# EasyEDA Pro project BLDC_V1.0.eprj

# Schematic Schematic1
Board Name: NCHANNEL_INVERTER; Create Date: 2025-03-22; Page Name: P1; Project Name: BLDC_V1.0; Schematic Name: Schematic1; Update Date: 2025-03-22; Company: EasyEDA.com; Page Size: A4; Version: V1.0
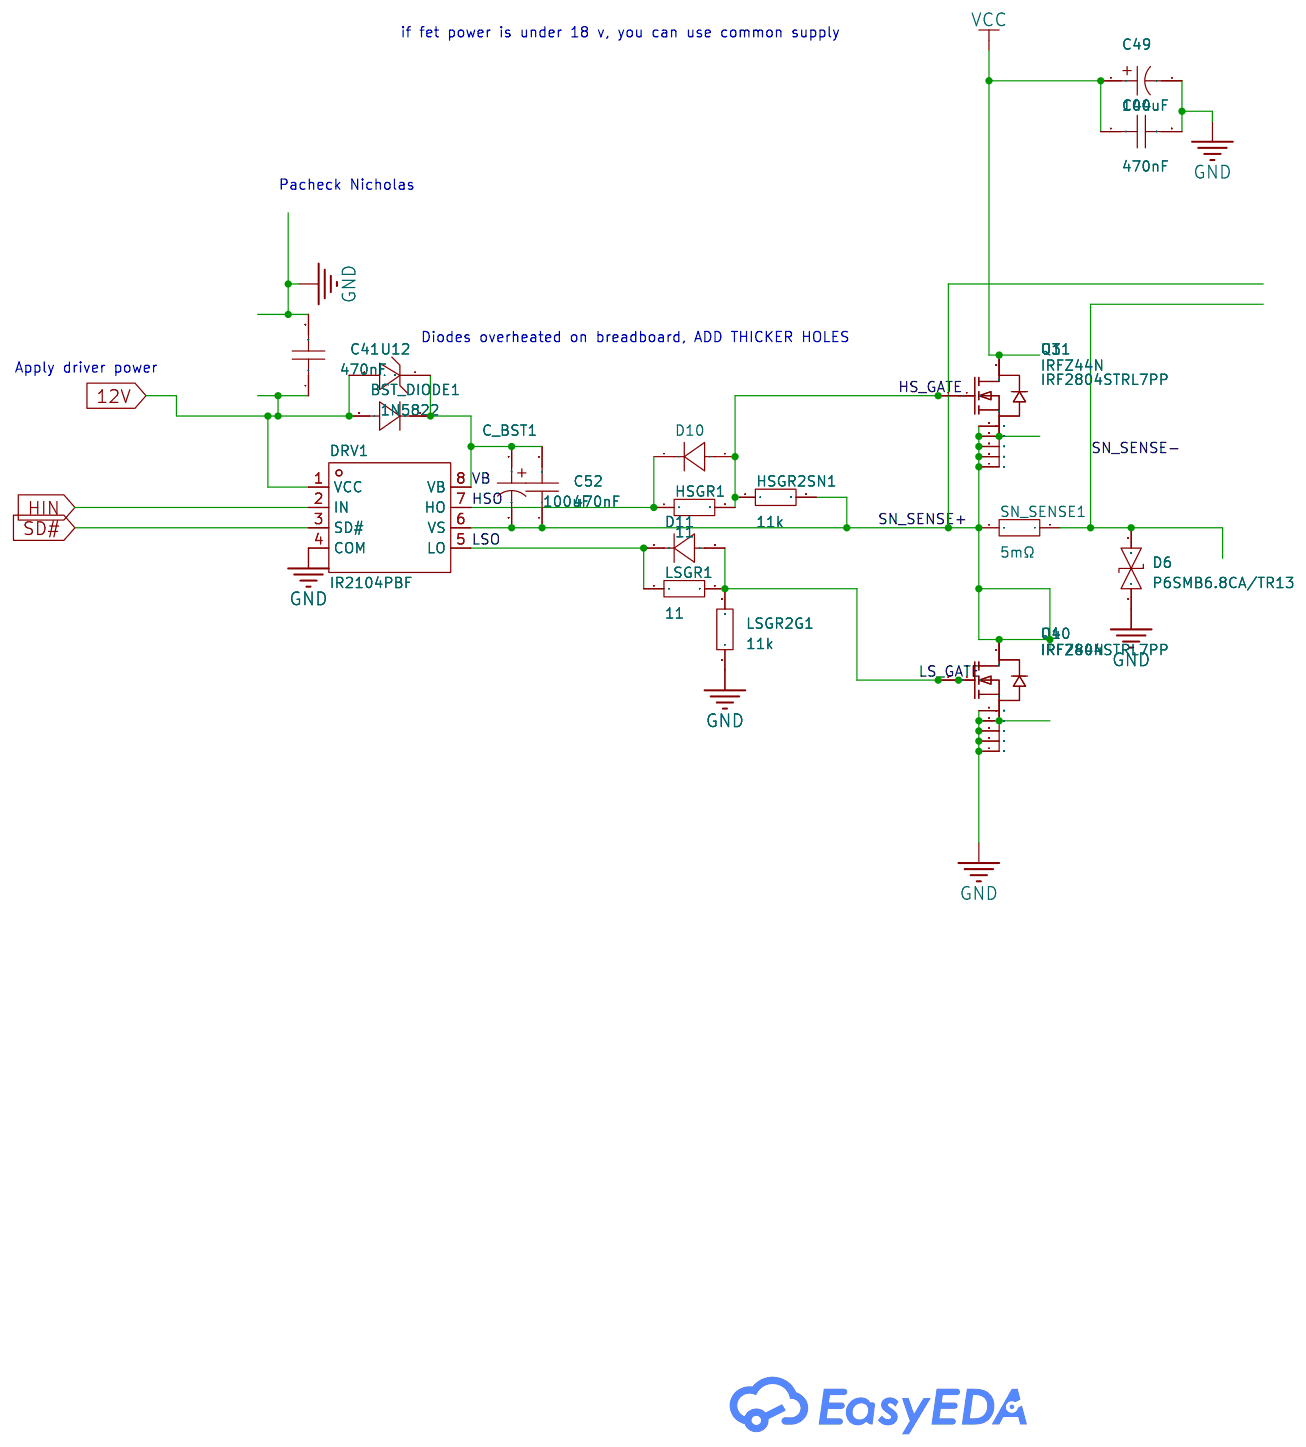
[diagram p0: schematic sheet]

## Parts
BST_DIODE1  -  [DO-41_BD2.4-L4.7-P8.70-D0.9-RD]
C41  470nF  [CAP-TH_L7.2-W2.5-P5.00-D0.5]
C44  470nF  [CAP-TH_L7.2-W2.5-P5.00-D0.5]
C49  100uF  [CAP-TH_BD8.0-P3.50-D0.6-FD]
C52  470nF  [CAP-TH_L7.2-W2.5-P5.00-D0.5]
C_BST1  100uF  [CAP-TH_BD8.0-P3.50-D0.6-FD]
CBB1  -
D6  P6SMB6.8CA/TR13  [SMB_L4.6-W3.6-LS5.3-BI]
D10  -  [DO-41_BD2.4-L4.7-P8.70-D0.9-RD]
D11  -  [DO-41_BD2.4-L4.7-P8.70-D0.9-RD]
DRV1  IR2104PBF  [DIP-8_L9.9-W6.6-P2.54-LS7.62-BL]
HSGR1  11  [RES-TH_BD3.3-L9.0-P13.00-D0.6]
HSGR2SN1  11k  [RES-TH_BD3.3-L9.0-P13.00-D0.6]
LSGR1  11  [RES-TH_BD3.3-L9.0-P13.00-D0.6]
LSGR2G1  11k  [RES-TH_BD3.3-L9.0-P13.00-D0.6]
Q3  IRF2804STRL7PP  [D2PAK-7_L10.6-W9.6-P1.27-LS15.9-BR]
Q4  IRF2804STRL7PP  [D2PAK-7_L10.6-W9.6-P1.27-LS15.9-BR]
SN_SENSE1  5mΩ  [R2512]
U10  IRFZ44N  [TO-220-3_L9.9-W4.5-P2.54-L]
U11  IRFZ44N  [TO-220-3_L9.9-W4.5-P2.54-L]
U12  1N5822  [SMA_L4.3-W2.6-LS5.1-RD]

## Library data of the parts
BST_DIODE1 D10 D11 = 1N4007: Supplier Footprint: DO-41
C41 C44 C52 = C241J474J20C000: Capacitance:470nF Tolerance:±5% Tolerance:±5% Voltage Rated: Dielectric Material:Metallized Polyester Film Capacitor Operating Temperature:-55℃~+125℃ Operating Temperature:-55℃~+125℃; LCSC Part Name: 470nF ±5% 63V; Supplier Part: C5121927; Manufacturer: faratronic(厦门法拉); Supplier Footprint: 插件,P=5mm; JLCPCB Part Class: Extended Part; Datasheet: https://atta.szlcsc.com/upload/public/pdf/source/20220309/53E9D6585E584592026F1B9FCED89B93.pdf; Supplier: LCSC; Tolerance: ±5%; Dielectric Material: Metallized Polyester Film Capacitor; Operating Temperature: -55℃~+125℃
C49 C_BST1 = EGT226M2AF12RR: Capacitance: Tolerance:±20% Tolerance:±20% Rated Voltage: Ripple Current:- Equivalent Series Resistance(ESR):- Lead Spacing: φD:- L:- Lifetime @ Temp:7000hrs@105℃ Operating Temperature:-45℃~+105℃ Operating Temperature:-45℃~+105℃; LCSC Part Name: 22uF ±20% 100V; Supplier Part: C840214; Manufacturer: MAN YUE(万裕科技); Supplier Footprint: 插件; JLCPCB Part Class: Extended Part; Datasheet: https://atta.szlcsc.com/upload/public/pdf/source/20181204/C235371_127DC39C6F805AD99E748A9DC446523D.pdf; Supplier: LCSC; Tolerance: ±20%; Lifetime @ Temp: 7000hrs@105℃; Operating Temperature: -45℃~+105℃
D6 = P6SMB6.8CA/TR13: Reverse Stand-Off Voltage (Vrwm):5.8V Maximum Clamping Voltage:10.5V Peak Pulse Current (Ipp)@10/1000us:58.1A Peak Pulse Power Dissipation (Ppp)@10/1000us:600W Breakdown Voltage:6.45V Type:TVS; Supplier Part: C78395; Manufacturer: Brightking(君耀电子); Supplier Footprint: SMB(DO-214AA); JLCPCB Part Class: Basic Part; Datasheet: https://atta.szlcsc.com/upload/public/pdf/source/20160709/1468031879762.pdf; Supplier: LCSC; Reverse Stand-Off Voltage (Vrwm): 5.8V; Maximum Clamping Voltage: 10.5V; Peak Pulse Current (Ipp)@10/1000us: 58.1A; Peak Pulse Power Dissipation (Ppp)@10/1000us: 600W; Breakdown Voltage: 6.45V; Type: TVS
DRV1 = IR2104PBF: Driven Configuration:Half Bridge Load Type:MOSFET；IGBT Number of Drivers:2 Peak Output Current(sink):360mA Peak Output Current(source):210mA Supply Voltage:10V~20V Supply Voltage:10V~20V Rise Time:100ns Fall Time:50ns Operating Temperature:-40℃~+150℃@(Tj); LCSC Part Name: IR2104PBF 停产; Supplier Part: C2959; Manufacturer: Infineon(英飞凌); Supplier Footprint: PDIP-8; JLCPCB Part Class: Extended Part; Datasheet: https://atta.szlcsc.com/upload/public/pdf/source/20140906/1457707236579.pdf; Supplier: LCSC; Driven Configuration: Half Bridge; Load Type: MOSFET；IGBT; Number of Drivers: 2; Peak Output Current(sink): 360mA; Peak Output Current(source): 210mA; Supply Voltage: 10V~20V; Rise Time: 100ns; Fall Time: 50ns; Operating Temperature: -40℃~+150℃@(Tj)
HSGR1 HSGR2SN1 LSGR1 LSGR2G1 = Res_AXIAL-1/2W: Supplier Footprint: Through
Q3 Q4 = IRF2804STRL7PP: Supplier Part: C459950; Manufacturer: Infineon(英飞凌); Supplier Footprint: TO-252-3; JLCPCB Part Class: Extended Part; Datasheet: https://atta.szlcsc.com/upload/public/pdf/source/20211220/39CD65D483719D465F1A88FFAD2C5DF5.pdf; Supplier: LCSC
SN_SENSE1 = PA2512FKF7W0R005E: Type:Current Sensing Resistors Resistance: Tolerance:±1% Tolerance:±1% Power(Watts): Temperature Coefficient:±100ppm/℃ Temperature Coefficient:±100ppm/℃; LCSC Part Name: 5mΩ ±1% 2W; Supplier Part: C309526; Manufacturer: YAGEO(国巨); Supplier Footprint: 2512; JLCPCB Part Class: Extended Part; Datasheet: https://atta.szlcsc.com/upload/public/pdf/source/20190227/C375693_219964CC8B3EBD36DBDF701587FA5938.pdf; Supplier: LCSC; Type: Current Sensing Resistors; Tolerance: ±1%; Temperature Coefficient: ±100ppm/℃
U10 U11 = IRFZ44N: Type:1个NChannel Drain Source Voltage (Vdss):60V Continuous Drain Current (Id): Power Dissipation (Pd): Drain Source On Resistance (RDS(on)@Vgs,Id):12mΩ@10V,25A Gate Threshold Voltage (Vgs(th)@Id):3V@250uA Total Gate Charge (Qg@Vgs):31nC@10V Input Capacita; LCSC Part Name: 1个N沟道 耐压:60V 电流:60A; Supplier Part: C7429904; Manufacturer: minos(迈诺斯); Supplier Footprint: TO-220; JLCPCB Part Class: Extended Part; Datasheet: https://atta.szlcsc.com/upload/public/pdf/source/20230807/91A846AFF378822B6B73E3D1D52219D8.pdf; Supplier: LCSC; Type: 1个NChannel; Drain Source Voltage (Vdss): 60V; Drain Source On Resistance (RDS(on)@Vgs,Id): 12mΩ@10V,25A; Gate Threshold Voltage (Vgs(th)@Id): 3V@250uA; Total Gate Charge (Qg@Vgs): 31nC@10V; Input Capacitance (Ciss@Vds): 910pF@25V; Reverse Transfer Capacitance (Crss@Vds): 30pF@25V; Operating Temperature: -55℃~+175℃@(Tj)
U12 = 1N5822_C9900009641: Supplier Part: C9900009641; JLCPCB Part Class: Extended Part; Supplier: LCSC

## Nets
12V: BST_DIODE1.2(A) C41.1 DRV1.1(VCC) U12.2(A)
GND: C41.2 C44.2 C49.2 D6.1 DRV1.4(COM) LSGR2G1.1 Q4.2(S) Q4.3(S) Q4.5(S) Q4.6(S) Q4.7(S) U10.3(S)
VCC: C44.1 C49.1 Q3.4(D) U11.2(D)
HIN: DRV1.2(IN)
HS_GATE: D10.2(A) HSGR1.2 HSGR2SN1.1 Q3.1(G) U11.1(G)
HSO: D10.1(K) DRV1.7(HO) HSGR1.1
LS_GATE: D11.2(A) LSGR1.2 LSGR2G1.2 Q4.1(G) U10.1(G)
LSO: D11.1(K) DRV1.5(LO) LSGR1.1
SD#: DRV1.3(SD#)
SN_SENSE+: C52.1 C_BST1.2 CBB1.(CS_AmpOut) D6.2 DRV1.6(VS) HSGR2SN1.2 Q3.2(S) Q3.3(S) Q3.5(S) Q3.6(S) Q3.7(S) Q4.4(D) SN_SENSE1.1 SN_SENSE1.2 U10.2(D) U11.3(S)
VB: BST_DIODE1.1(K) C52.2 C_BST1.1 DRV1.8(VB) U12.1(C)

## Notes on the sheet
- if fet power is under 18 v, you can use common supply
- Pacheck Nicholas
- Diodes overheated on breadboard, ADD THICKER HOLES
- Apply driver power

# Schematic CurrentSenseAmplfier
Board Name: CurrentSenseAmplfier; Create Date: 2025-03-22; Page Name: P1; Project Name: CurrentSenseAmplfier; Schematic Name: CurrentSenseAmplfier; Update Date: 2025-03-22; Company: EasyEDA.com; Page Size: A4; Version: V1.0
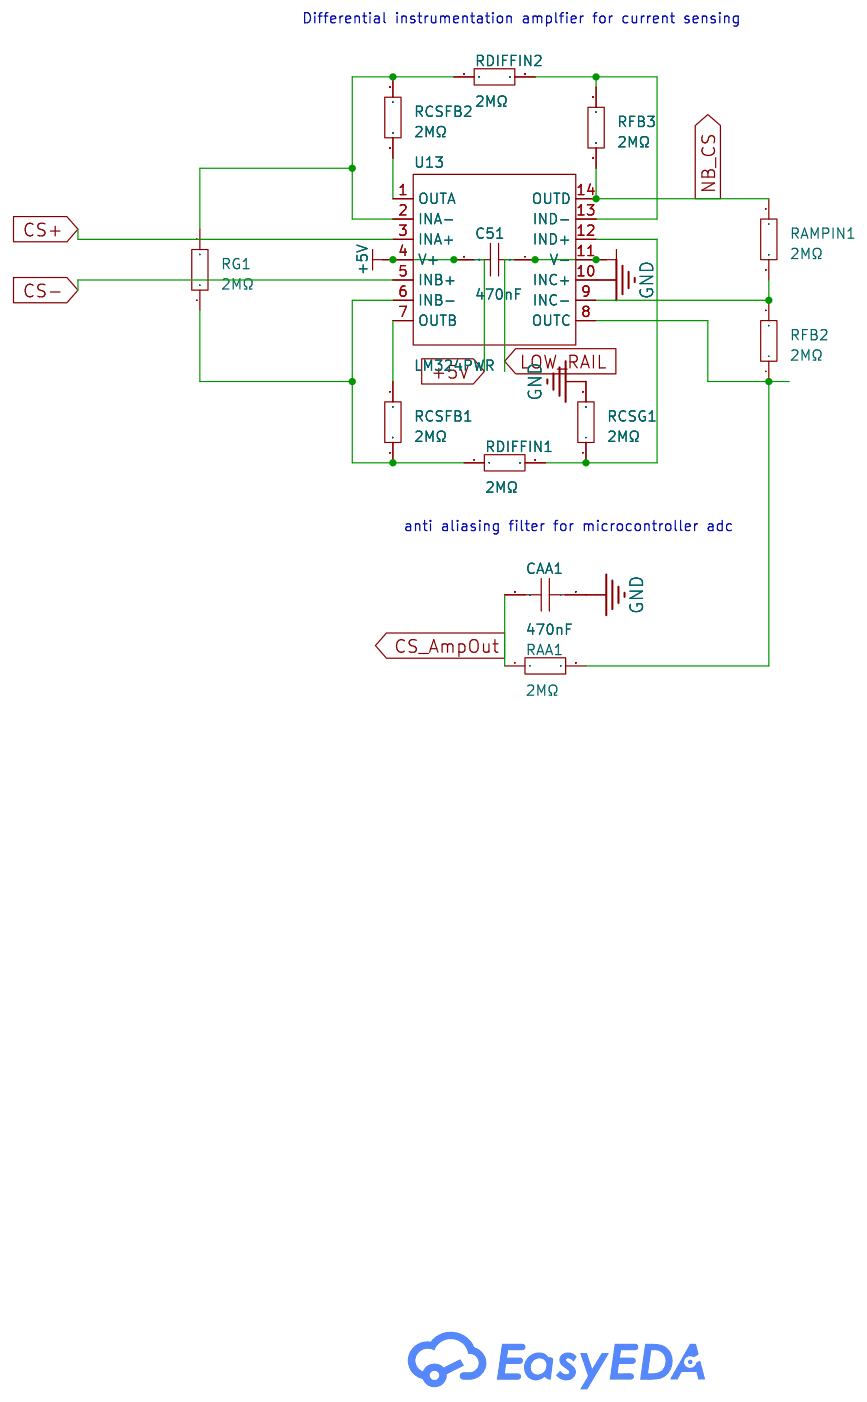
[diagram p1: schematic sheet]

## Parts
C51  470nF  [CAP-TH_L7.2-W2.5-P5.00-D0.5]
CAA1  470nF  [CAP-TH_L7.2-W2.5-P5.00-D0.5]
RAA1  2MΩ  [R0805]
RAMPIN1  2MΩ  [R0805]
RCSFB1  2MΩ  [R0805]
RCSFB2  2MΩ  [R0805]
RCSG1  2MΩ  [R0805]
RDIFFIN1  2MΩ  [R0805]
RDIFFIN2  2MΩ  [R0805]
RFB2  2MΩ  [R0805]
RFB3  2MΩ  [R0805]
RG1  2MΩ  [R0805]
U13  LM324PWR  [TSSOP-14_L5.0-W4.4-P0.65-LS6.4-BL]

## Library data of the parts
C51 CAA1 = C241J474J20C000: Capacitance:470nF Tolerance:±5% Tolerance:±5% Voltage Rated: Dielectric Material:Metallized Polyester Film Capacitor Operating Temperature:-55℃~+125℃ Operating Temperature:-55℃~+125℃; LCSC Part Name: 470nF ±5% 63V; Supplier Part: C5121927; Manufacturer: faratronic(厦门法拉); Supplier Footprint: 插件,P=5mm; JLCPCB Part Class: Extended Part; Datasheet: https://atta.szlcsc.com/upload/public/pdf/source/20220309/53E9D6585E584592026F1B9FCED89B93.pdf; Supplier: LCSC; Tolerance: ±5%; Dielectric Material: Metallized Polyester Film Capacitor; Operating Temperature: -55℃~+125℃
RAA1 RAMPIN1 RCSFB1 RCSFB2 RCSG1 RDIFFIN1 RDIFFIN2 RFB2 RFB3 RG1 = SCR0805J2M: Type:Thick Film Resistors Resistance:2MΩ Tolerance:±5% Tolerance:±5% Power(Watts): Overload Voltage (Max): Operating Temperature Range:-55℃~+155℃ Operating Temperature Range:-55℃~+155℃; LCSC Part Name: 厚膜电阻 2MΩ ±5% 125mW; Supplier Part: C3017921; Manufacturer: VO(翔胜); Supplier Footprint: 0805; JLCPCB Part Class: Extended Part; Datasheet: https://atta.szlcsc.com/upload/public/pdf/source/20220513/247AF9639BA21CF93567DC289CCC6A22.pdf; Supplier: LCSC; Type: Thick Film Resistors; Tolerance: ±5%; Operating Temperature Range: -55℃~+155℃
U13 = LM324PWR: Number of Circuits:Quad Gain Bandwidth Product(GBP):1.2MHz Current - Input Bias(Ib):20nA Slew Rate(SR):0.5V/us Output Current:30mA -3db Bandwidth:- Supply Current:700uA Operating Temperature:0℃~+70℃ Operating Temperature:0℃~+70℃; Supplier Part: C7942; Manufacturer: TI(德州仪器); Supplier Footprint: TSSOP-14; JLCPCB Part Class: Extended Part; Datasheet: http://www.ti.com/cn/lit/gpn/lm324; Supplier: LCSC; Number of Circuits: Quad; Gain Bandwidth Product(GBP): 1.2MHz; Current - Input Bias(Ib): 20nA; Slew Rate(SR): 0.5V/us; Output Current: 30mA; Supply Current: 700uA; Operating Temperature: 0℃~+70℃

## Nets
+5V: C51.2 U13.4(V+)
GND: CAA1.1 RCSG1.2 U13.10(INC+)
CS+: U13.3(INA+)
CS-: U13.5(INB+)
CS_AmpOut: CAA1.2 RAA1.1
LOW_RAIL: C51.1 U13.11(V-)
NB_CS: RAMPIN1.1 RFB3.1 U13.14(OUTD)
$1N640: RAMPIN1.2 RFB2.2 U13.9(INC-)
$1N642: RDIFFIN2.2 RFB3.2 U13.13(IND-)
$1N644: RCSG1.1 RDIFFIN1.2 U13.12(IND+)
$1N647: RCSFB2.1 RDIFFIN2.1 RG1.2 U13.2(INA-)
$1N648: RCSFB1.2 RDIFFIN1.1 RG1.1 U13.6(INB-)
$1N649: RCSFB1.1 U13.7(OUTB)
$1N650: RCSFB2.2 U13.1(OUTA)
$1N669: RAA1.2 RFB2.1 U13.8(OUTC)

## Notes on the sheet
- Differential instrumentation amplfier for current sensing
- anti aliasing filter for microcontroller adc

# Schematic Schematic2_2
Board Name: SPDV4_THT_2; Create Date: 2025-03-22; Page Name: P1; Project Name: BLDCv5; Schematic Name: Schematic2_2; Update Date: 2025-03-22; Company: EasyEDA.com; Drawn: EasyEDA; Page Size: A4; Part Number: JLCPCB-002; Reviewed: EasyEDA; Version: V0.1
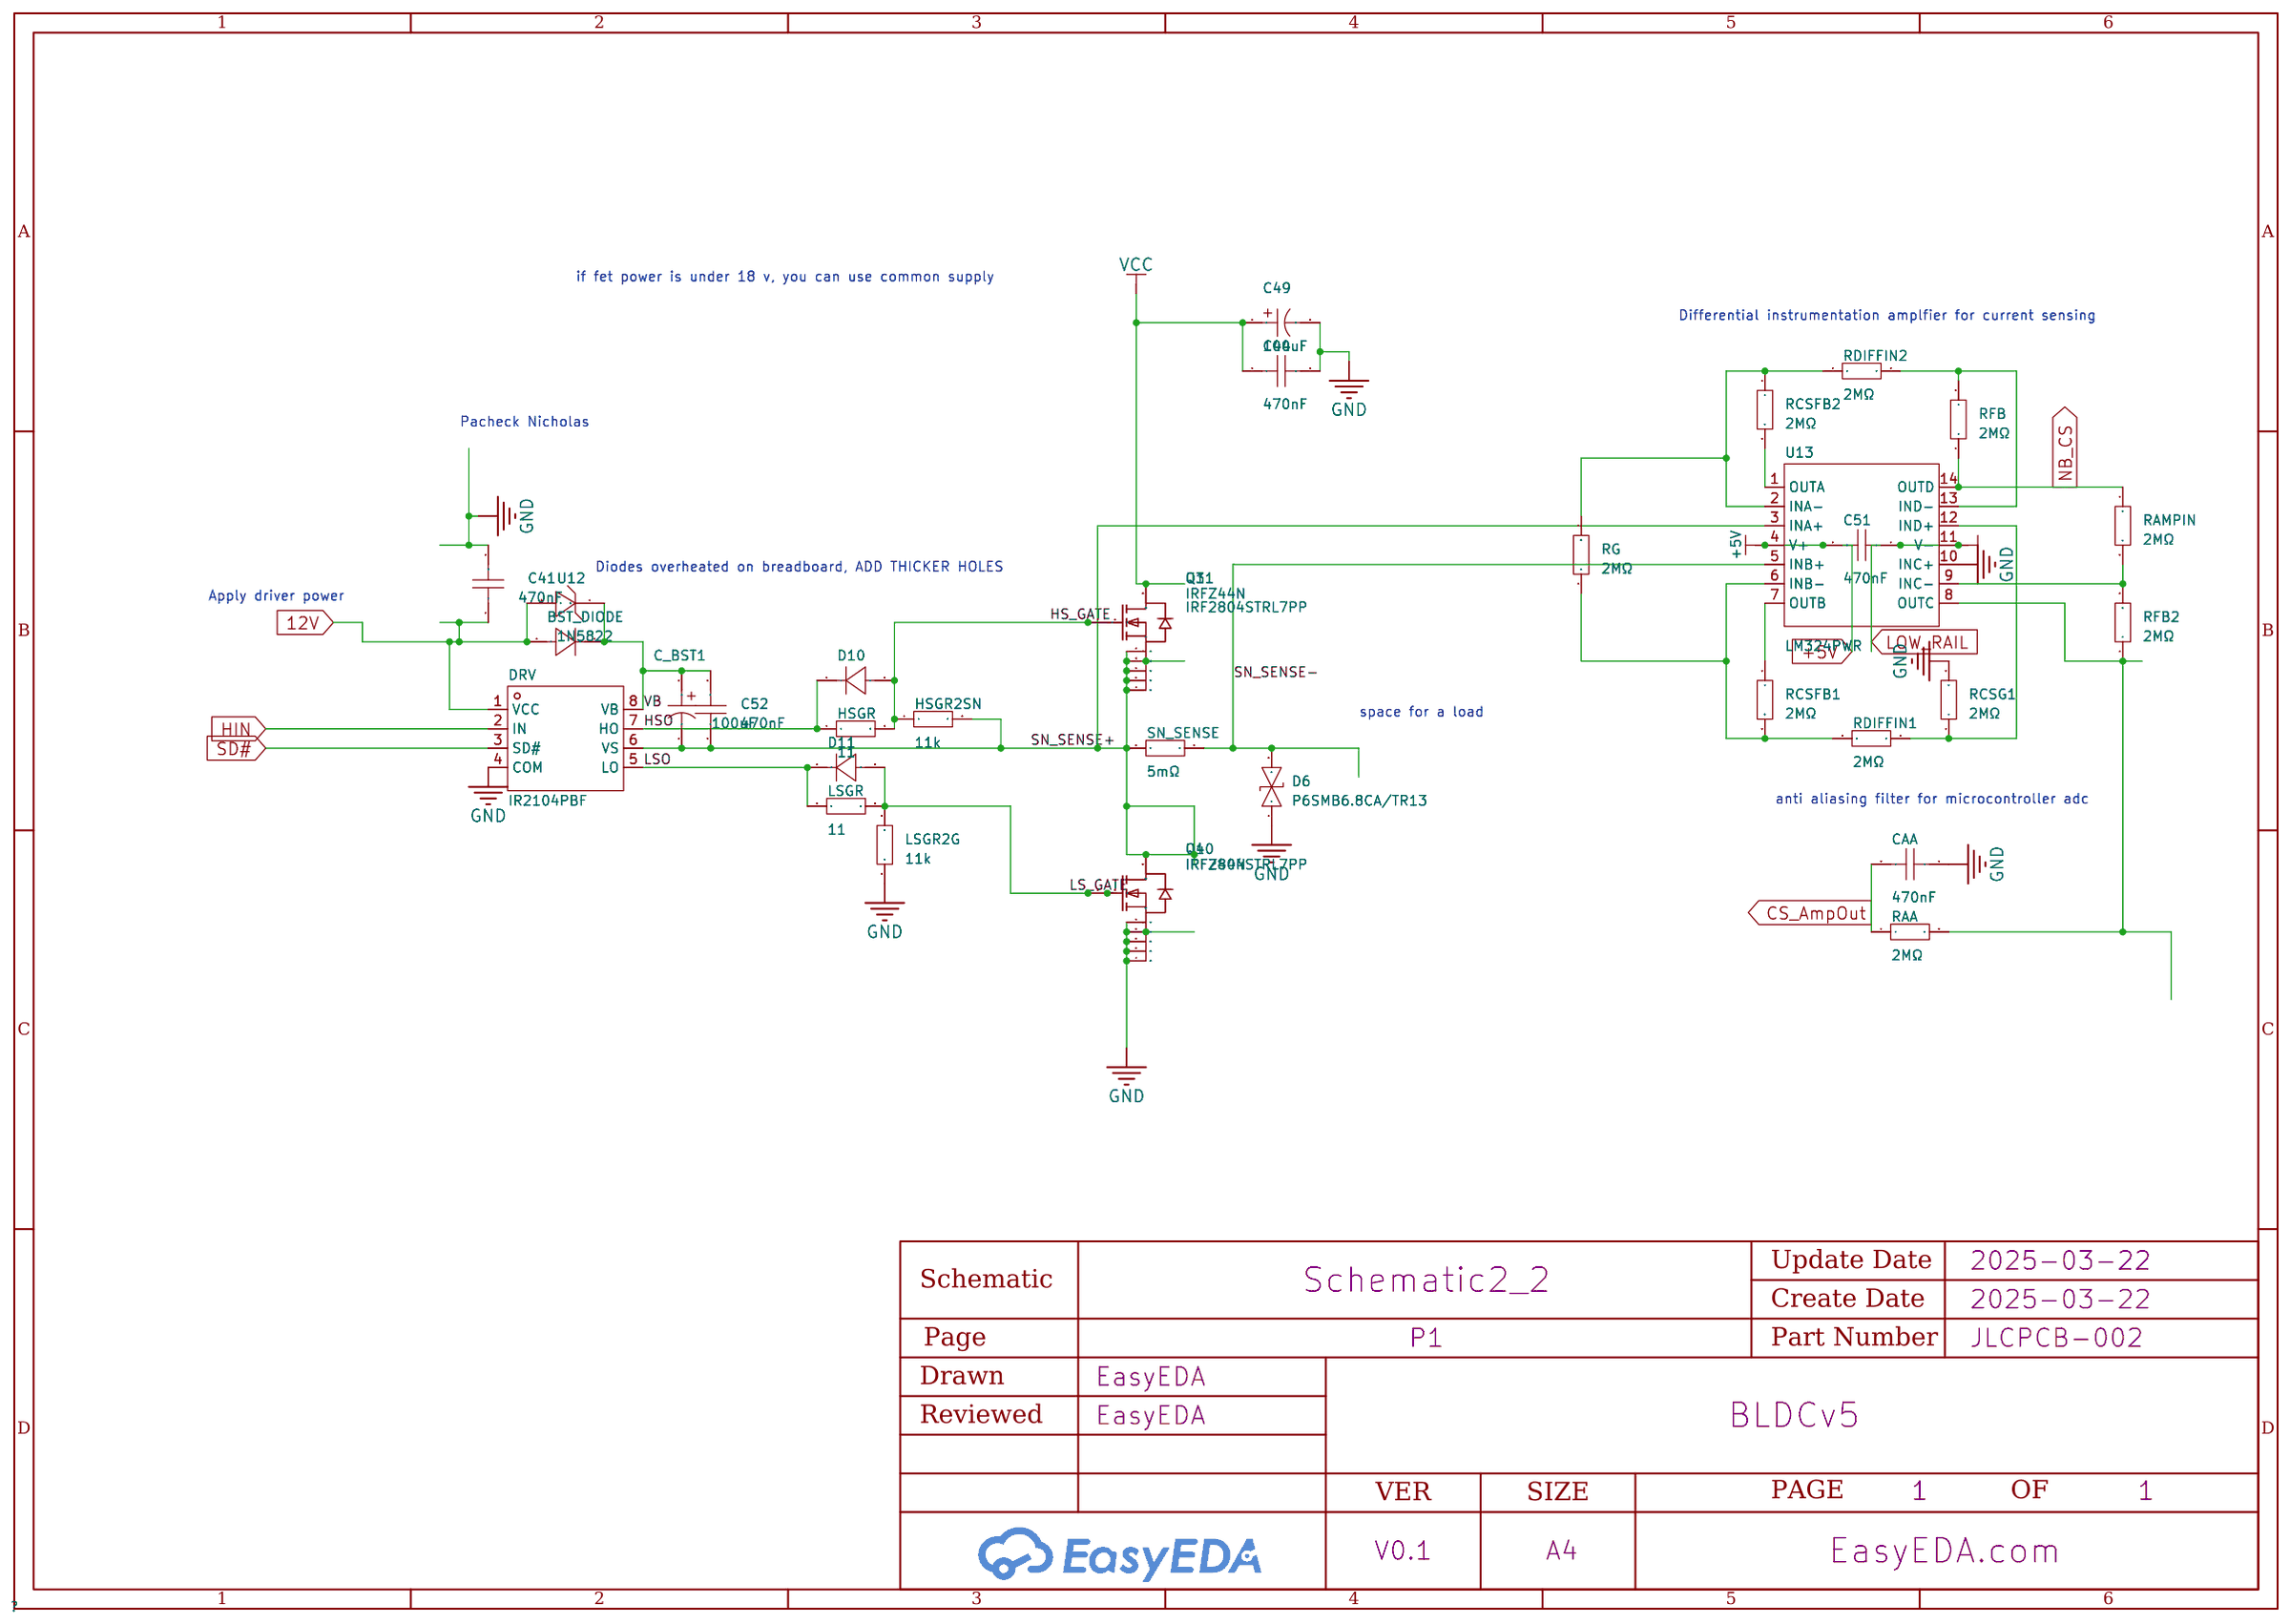
[diagram p2: schematic sheet]

## Parts
BST_DIODE  -  [DO-41_BD2.4-L4.7-P8.70-D0.9-RD]
C41  470nF  [CAP-TH_L7.2-W2.5-P5.00-D0.5]
C44  470nF  [CAP-TH_L7.2-W2.5-P5.00-D0.5]
C49  100uF  [CAP-TH_BD8.0-P3.50-D0.6-FD]
C51  470nF  [CAP-TH_L7.2-W2.5-P5.00-D0.5]
C52  470nF  [CAP-TH_L7.2-W2.5-P5.00-D0.5]
C_BST1  100uF  [CAP-TH_BD8.0-P3.50-D0.6-FD]
CAA  470nF  [CAP-TH_L7.2-W2.5-P5.00-D0.5]
D6  P6SMB6.8CA/TR13  [SMB_L4.6-W3.6-LS5.3-BI]
D10  -  [DO-41_BD2.4-L4.7-P8.70-D0.9-RD]
D11  -  [DO-41_BD2.4-L4.7-P8.70-D0.9-RD]
DRV  IR2104PBF  [DIP-8_L9.9-W6.6-P2.54-LS7.62-BL]
HSGR  11  [RES-TH_BD3.3-L9.0-P13.00-D0.6]
HSGR2SN  11k  [RES-TH_BD3.3-L9.0-P13.00-D0.6]
LSGR  11  [RES-TH_BD3.3-L9.0-P13.00-D0.6]
LSGR2G  11k  [RES-TH_BD3.3-L9.0-P13.00-D0.6]
Q3  IRF2804STRL7PP  [D2PAK-7_L10.6-W9.6-P1.27-LS15.9-BR]
Q4  IRF2804STRL7PP  [D2PAK-7_L10.6-W9.6-P1.27-LS15.9-BR]
RAA  2MΩ  [R0805]
RAMPIN  2MΩ  [R0805]
RCSFB1  2MΩ  [R0805]
RCSFB2  2MΩ  [R0805]
RCSG1  2MΩ  [R0805]
RDIFFIN1  2MΩ  [R0805]
RDIFFIN2  2MΩ  [R0805]
RFB  2MΩ  [R0805]
RFB2  2MΩ  [R0805]
RG  2MΩ  [R0805]
SN_SENSE  5mΩ  [R2512]
U10  IRFZ44N  [TO-220-3_L9.9-W4.5-P2.54-L]
U11  IRFZ44N  [TO-220-3_L9.9-W4.5-P2.54-L]
U12  1N5822  [SMA_L4.3-W2.6-LS5.1-RD]
U13  LM324PWR  [TSSOP-14_L5.0-W4.4-P0.65-LS6.4-BL]

## Library data of the parts
BST_DIODE D10 D11 = 1N4007: Supplier Footprint: DO-41
C41 C44 C51 C52 CAA = C241J474J20C000: Capacitance:470nF Tolerance:±5% Tolerance:±5% Voltage Rated: Dielectric Material:Metallized Polyester Film Capacitor Operating Temperature:-55℃~+125℃ Operating Temperature:-55℃~+125℃; LCSC Part Name: 470nF ±5% 63V; Supplier Part: C5121927; Manufacturer: faratronic(厦门法拉); Supplier Footprint: 插件,P=5mm; JLCPCB Part Class: Extended Part; Datasheet: https://atta.szlcsc.com/upload/public/pdf/source/20220309/53E9D6585E584592026F1B9FCED89B93.pdf; Supplier: LCSC; Tolerance: ±5%; Dielectric Material: Metallized Polyester Film Capacitor; Operating Temperature: -55℃~+125℃
C49 C_BST1 = EGT226M2AF12RR: Capacitance: Tolerance:±20% Tolerance:±20% Rated Voltage: Ripple Current:- Equivalent Series Resistance(ESR):- Lead Spacing: φD:- L:- Lifetime @ Temp:7000hrs@105℃ Operating Temperature:-45℃~+105℃ Operating Temperature:-45℃~+105℃; LCSC Part Name: 22uF ±20% 100V; Supplier Part: C840214; Manufacturer: MAN YUE(万裕科技); Supplier Footprint: 插件; JLCPCB Part Class: Extended Part; Datasheet: https://atta.szlcsc.com/upload/public/pdf/source/20181204/C235371_127DC39C6F805AD99E748A9DC446523D.pdf; Supplier: LCSC; Tolerance: ±20%; Lifetime @ Temp: 7000hrs@105℃; Operating Temperature: -45℃~+105℃
D6 = P6SMB6.8CA/TR13: Reverse Stand-Off Voltage (Vrwm):5.8V Maximum Clamping Voltage:10.5V Peak Pulse Current (Ipp)@10/1000us:58.1A Peak Pulse Power Dissipation (Ppp)@10/1000us:600W Breakdown Voltage:6.45V Type:TVS; Supplier Part: C78395; Manufacturer: Brightking(君耀电子); Supplier Footprint: SMB(DO-214AA); JLCPCB Part Class: Basic Part; Datasheet: https://atta.szlcsc.com/upload/public/pdf/source/20160709/1468031879762.pdf; Supplier: LCSC; Reverse Stand-Off Voltage (Vrwm): 5.8V; Maximum Clamping Voltage: 10.5V; Peak Pulse Current (Ipp)@10/1000us: 58.1A; Peak Pulse Power Dissipation (Ppp)@10/1000us: 600W; Breakdown Voltage: 6.45V; Type: TVS
DRV = IR2104PBF: Driven Configuration:Half Bridge Load Type:MOSFET；IGBT Number of Drivers:2 Peak Output Current(sink):360mA Peak Output Current(source):210mA Supply Voltage:10V~20V Supply Voltage:10V~20V Rise Time:100ns Fall Time:50ns Operating Temperature:-40℃~+150℃@(Tj); LCSC Part Name: IR2104PBF 停产; Supplier Part: C2959; Manufacturer: Infineon(英飞凌); Supplier Footprint: PDIP-8; JLCPCB Part Class: Extended Part; Datasheet: https://atta.szlcsc.com/upload/public/pdf/source/20140906/1457707236579.pdf; Supplier: LCSC; Driven Configuration: Half Bridge; Load Type: MOSFET；IGBT; Number of Drivers: 2; Peak Output Current(sink): 360mA; Peak Output Current(source): 210mA; Supply Voltage: 10V~20V; Rise Time: 100ns; Fall Time: 50ns; Operating Temperature: -40℃~+150℃@(Tj)
HSGR HSGR2SN LSGR LSGR2G = Res_AXIAL-1/2W: Supplier Footprint: Through
Q3 Q4 = IRF2804STRL7PP: Supplier Part: C459950; Manufacturer: Infineon(英飞凌); Supplier Footprint: TO-252-3; JLCPCB Part Class: Extended Part; Datasheet: https://atta.szlcsc.com/upload/public/pdf/source/20211220/39CD65D483719D465F1A88FFAD2C5DF5.pdf; Supplier: LCSC
RAA RAMPIN RCSFB1 RCSFB2 RCSG1 RDIFFIN1 RDIFFIN2 RFB RFB2 RG = SCR0805J2M: Type:Thick Film Resistors Resistance:2MΩ Tolerance:±5% Tolerance:±5% Power(Watts): Overload Voltage (Max): Operating Temperature Range:-55℃~+155℃ Operating Temperature Range:-55℃~+155℃; LCSC Part Name: 厚膜电阻 2MΩ ±5% 125mW; Supplier Part: C3017921; Manufacturer: VO(翔胜); Supplier Footprint: 0805; JLCPCB Part Class: Extended Part; Datasheet: https://atta.szlcsc.com/upload/public/pdf/source/20220513/247AF9639BA21CF93567DC289CCC6A22.pdf; Supplier: LCSC; Type: Thick Film Resistors; Tolerance: ±5%; Operating Temperature Range: -55℃~+155℃
SN_SENSE = PA2512FKF7W0R005E: Type:Current Sensing Resistors Resistance: Tolerance:±1% Tolerance:±1% Power(Watts): Temperature Coefficient:±100ppm/℃ Temperature Coefficient:±100ppm/℃; LCSC Part Name: 5mΩ ±1% 2W; Supplier Part: C309526; Manufacturer: YAGEO(国巨); Supplier Footprint: 2512; JLCPCB Part Class: Extended Part; Datasheet: https://atta.szlcsc.com/upload/public/pdf/source/20190227/C375693_219964CC8B3EBD36DBDF701587FA5938.pdf; Supplier: LCSC; Type: Current Sensing Resistors; Tolerance: ±1%; Temperature Coefficient: ±100ppm/℃
U10 U11 = IRFZ44N: Type:1个NChannel Drain Source Voltage (Vdss):60V Continuous Drain Current (Id): Power Dissipation (Pd): Drain Source On Resistance (RDS(on)@Vgs,Id):12mΩ@10V,25A Gate Threshold Voltage (Vgs(th)@Id):3V@250uA Total Gate Charge (Qg@Vgs):31nC@10V Input Capacita; LCSC Part Name: 1个N沟道 耐压:60V 电流:60A; Supplier Part: C7429904; Manufacturer: minos(迈诺斯); Supplier Footprint: TO-220; JLCPCB Part Class: Extended Part; Datasheet: https://atta.szlcsc.com/upload/public/pdf/source/20230807/91A846AFF378822B6B73E3D1D52219D8.pdf; Supplier: LCSC; Type: 1个NChannel; Drain Source Voltage (Vdss): 60V; Drain Source On Resistance (RDS(on)@Vgs,Id): 12mΩ@10V,25A; Gate Threshold Voltage (Vgs(th)@Id): 3V@250uA; Total Gate Charge (Qg@Vgs): 31nC@10V; Input Capacitance (Ciss@Vds): 910pF@25V; Reverse Transfer Capacitance (Crss@Vds): 30pF@25V; Operating Temperature: -55℃~+175℃@(Tj)
U12 = 1N5822_C9900009641: Supplier Part: C9900009641; JLCPCB Part Class: Extended Part; Supplier: LCSC
U13 = LM324PWR: Number of Circuits:Quad Gain Bandwidth Product(GBP):1.2MHz Current - Input Bias(Ib):20nA Slew Rate(SR):0.5V/us Output Current:30mA -3db Bandwidth:- Supply Current:700uA Operating Temperature:0℃~+70℃ Operating Temperature:0℃~+70℃; Supplier Part: C7942; Manufacturer: TI(德州仪器); Supplier Footprint: TSSOP-14; JLCPCB Part Class: Extended Part; Datasheet: http://www.ti.com/cn/lit/gpn/lm324; Supplier: LCSC; Number of Circuits: Quad; Gain Bandwidth Product(GBP): 1.2MHz; Current - Input Bias(Ib): 20nA; Slew Rate(SR): 0.5V/us; Output Current: 30mA; Supply Current: 700uA; Operating Temperature: 0℃~+70℃

## Nets
12V: BST_DIODE.2(A) C41.1 DRV.1(VCC) U12.2(A)
+5V: C51.2 U13.4(V+)
GND: C41.2 C44.2 C49.2 CAA.1 D6.1 DRV.4(COM) LSGR2G.1 Q4.2(S) Q4.3(S) Q4.5(S) Q4.6(S) Q4.7(S) RCSG1.2 U10.3(S) U13.10(INC+)
VCC: C44.1 C49.1 Q3.4(D) U11.2(D)
CS_AmpOut: CAA.2 RAA.1
HIN: DRV.2(IN)
HS_GATE: D10.2(A) HSGR.2 HSGR2SN.1 Q3.1(G) U11.1(G)
HSO: D10.1(K) DRV.7(HO) HSGR.1
LOW_RAIL: C51.1 U13.11(V-)
LS_GATE: D11.2(A) LSGR.2 LSGR2G.2 Q4.1(G) U10.1(G)
LSO: D11.1(K) DRV.5(LO) LSGR.1
NB_CS: RAMPIN.1 RFB.1 U13.14(OUTD)
SD#: DRV.3(SD#)
SN_SENSE+: C52.1 C_BST1.2 DRV.6(VS) HSGR2SN.2 Q3.2(S) Q3.3(S) Q3.5(S) Q3.6(S) Q3.7(S) Q4.4(D) SN_SENSE.2 U10.2(D) U11.3(S) U13.3(INA+)
SN_SENSE-: D6.2 SN_SENSE.1 U13.5(INB+)
VB: BST_DIODE.1(K) C52.2 C_BST1.1 DRV.8(VB) U12.1(C)
$1N9618: RCSFB2.2 U13.1(OUTA)
$1N9619: RCSFB1.1 U13.7(OUTB)
$1N9620: RCSFB1.2 RDIFFIN1.1 RG.1 U13.6(INB-)
$1N9621: RCSFB2.1 RDIFFIN2.1 RG.2 U13.2(INA-)
$1N9624: RCSG1.1 RDIFFIN1.2 U13.12(IND+)
$1N9626: RDIFFIN2.2 RFB.2 U13.13(IND-)
$1N9695: RAMPIN.2 RFB2.2 U13.9(INC-)
$1N10041: RAA.2 RFB2.1 U13.8(OUTC)

## Notes on the sheet
- if fet power is under 18 v, you can use common supply
- Differential instrumentation amplfier for current sensing
- Pacheck Nicholas
- Diodes overheated on breadboard, ADD THICKER HOLES
- Apply driver power
- space for a load
- anti aliasing filter for microcontroller adc

# Board CurrentSenseAmplfier
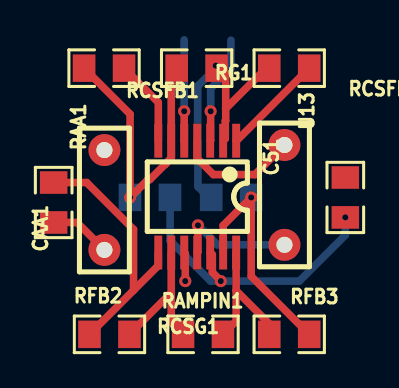
[diagram p3: board, top side]
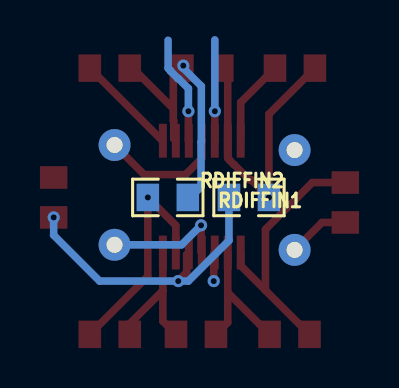
[diagram p4: board, bottom side, seen from below]

No outline. copper layers: Top Layer, Bottom Layer. Coordinates in mm from the lowest, leftmost part position.
Stack: Top Layer 0.035mm / Dielectric1 1.51mm FR4 er 4.5 / Bottom Layer 0.035mm

## Design rules (mm)
template: JLCPCB Capability(Two Layers Board)
spacing copperThickness1oz (default): track to track 0.102, other pairs 0.152 to 0.3
spacing copperThickness2oz: track to track 0.203, other pairs 0.152 to 0.3
track width copperThickness1oz (default): min 0.127, default 0.254, max 2.54
track width copperThickness2oz: min 0.203, default 0.254, max 2.54
differential pair differentialPair (default): width min 0.127, default 0.254, max 2.54; gap min 0.152, default 0.152
via viaSize (default): diameter min 0.5, default 0.61, max 10; hole min 0.3, default 0.305, max 6.3

## Placement (name value [footprint] x y rotation side)
C51  470nF  [CAP-TH_L7.2-W2.5-P5.00-D0.5]  11.56 6.98 90 top
CAA1  470nF  [CAP-TH_L7.2-W2.5-P5.00-D0.5]  2.54 6.73 270 top
RAA1  2MΩ  [R0805]  0 6.6 90 top
RAMPIN1  2MΩ  [R0805]  7.48 0 180 top
RCSFB1  2MΩ  [R0805]  2.52 13.33 180 top
RCSFB2  2MΩ  [R0805]  11.8 13.33 0 top
RCSG1  2MΩ  [R0805]  14.6 6.86 90 top
RDIFFIN1  2MΩ  [R0805]  4.83 6.86 0 bottom
RDIFFIN2  2MΩ  [R0805]  8.89 6.86 0 bottom
RFB2  2MΩ  [R0805]  2.79 0 0 top
RFB3  2MΩ  [R0805]  11.8 0 0 top
RG1  2MΩ  [R0805]  7.16 13.33 0 top
U13  LM324PWR  [TSSOP-14_L5.0-W4.4-P0.65-LS6.4-BL]  7.19 6.9 180 top

## Footprints (pads in the part's own frame, mm; a bottom-side part is the same pattern mirrored in y, then rotated)
CAP-TH_L7.2-W2.5-P5.00-D0.5
  round 1.6 hole 0.8: 1(-2.5,0) 2(2.5,0)
R0805
  rect 1.133x1.377 smd: 1(-1,0) 2(1,0)
TSSOP-14_L5.0-W4.4-P0.65-LS6.4-BL
  rect 0.4x1.7 smd: 1(-1.95,-2.8) 2(-1.3,-2.8) 3(-0.65,-2.8) 4(0,-2.8) 5(0.65,-2.8) 6(1.3,-2.8) 7(1.95,-2.8) 8(1.95,2.8) 9(1.3,2.8) 10(0.65,2.8) 11(0,2.8) 12(-0.65,2.8) 13(-1.3,2.8) 14(-1.95,2.8)

## Nets
As in the schematic, except:
CS_AMPOUT: CAA1.2 RAA1.1

## Via types
v1: diameter 0.61, hole 0.305, Top Layer to Bottom Layer, 9 vias

## Routing (per net, layer and track width the routed paths; a pad name or vN(x,y) marks a point on that pad's centre or on a via; arc(x,y) is an arc through that point)
+5V: length 6.2
  Top Layer w0.381: C51.2 10.07,8 8,8 7.19,8.81 U13.4
GND: length 1.5
  Top Layer w0.381: v1(6.59,2.67) 6.59,4.05 U13.10
CS+: length 5.5
  Top Layer w0.381: U13.3 7.86,9.72 v1(7.86,11.18)
  Bottom Layer w0.381: 8.88,14.73 8.88,13.33 8.76,13.22 8.76,13.19 8.38,12.81 8.35,12.81 7.86,12.32 v1(7.86,11.18)
CS-: length 5.1
  Top Layer w0.381: v1(6.53,11.18) 6.53,9.7 U13.5
  Bottom Layer w0.381: v1(6.53,11.18) 6.53,14.75
CS_AMPOUT: length 3.1
  Top Layer w0.381: CAA1.2 1.17,5.6 RAA1.1
LOW_RAIL: length 6.1
  Top Layer w0.381: v1(7.22,5.46) 7.22,4.14 U13.11
  Bottom Layer w0.381: v1(7.22,5.46) 8.2,4.48 C51.1
NB_CS: length 7.3
  Top Layer w0.381: RFB3.1 10.8,0.53 9.14,2.19 ; 9.14,2.19 9.14,0.66 RAMPIN1.1 ; 9.14,2.19 U13.14
$1N640: length 7.3
  Top Layer w0.381: 5.89,2.09 U13.9 ; 5.89,2.09 RFB2.2 ; 5.89,2.09 5.89,0.59 RAMPIN1.2
$1N642: length 11.4
  Top Layer w0.381: RFB3.2 9.89,2.91 v1(9.89,6.86) 8.49,5.46 U13.13
$1N644: length 15.3
  Top Layer w0.381: v1(8.37,2.67) 8.37,2.68 7.94,3.11 7.94,3.99 U13.12
  Bottom Layer w0.381: RDIFFIN1.2 5.83,4.7 7.86,2.67 v1(8.37,2.67) 12.3,2.67 14.6,4.97 v1(14.6,5.86)
$1N647: length 14.3
  Top Layer w0.381: RCSFB2.1 10.64,13.33 8.61,11.31 ; 8.61,11.31 8.61,10.71 8.59,10.69 8.59,9.81 U13.2 ; 8.61,11.31 8.61,13.01 8.29,13.33 RG1.2
  Bottom Layer w0.381: v1(8.11,13.46) 8.11,13.33 7.21,12.43 7.21,9.64 7.22,9.63 7.22,7.4 7.76,6.86 RDIFFIN2.1
$1N648: length 14.9
  Top Layer w0.381: RCSFB1.2 3.83,11.03 v1(3.83,6.86) 4.72,7.75 4.81,7.75 5.57,8.51 5.58,8.51 5.78,8.71 5.78,8.72 5.89,8.82 U13.6 5.89,13.06 RG1.1
$1N649: length 4.3
  Top Layer w0.381: U13.7 5.24,11.62 RCSFB1.1
$1N650: length 5.2
  Top Layer w0.381: RCSFB2.2 9.16,9.7 U13.1
$1N669: length 13.5
  Top Layer w0.381: 4,2.21 5.24,3.44 U13.8 ; 4,2.21 4,5.26 1.65,7.6 RAA1.2 ; 4,2.21 RFB2.1

# Board PCB5
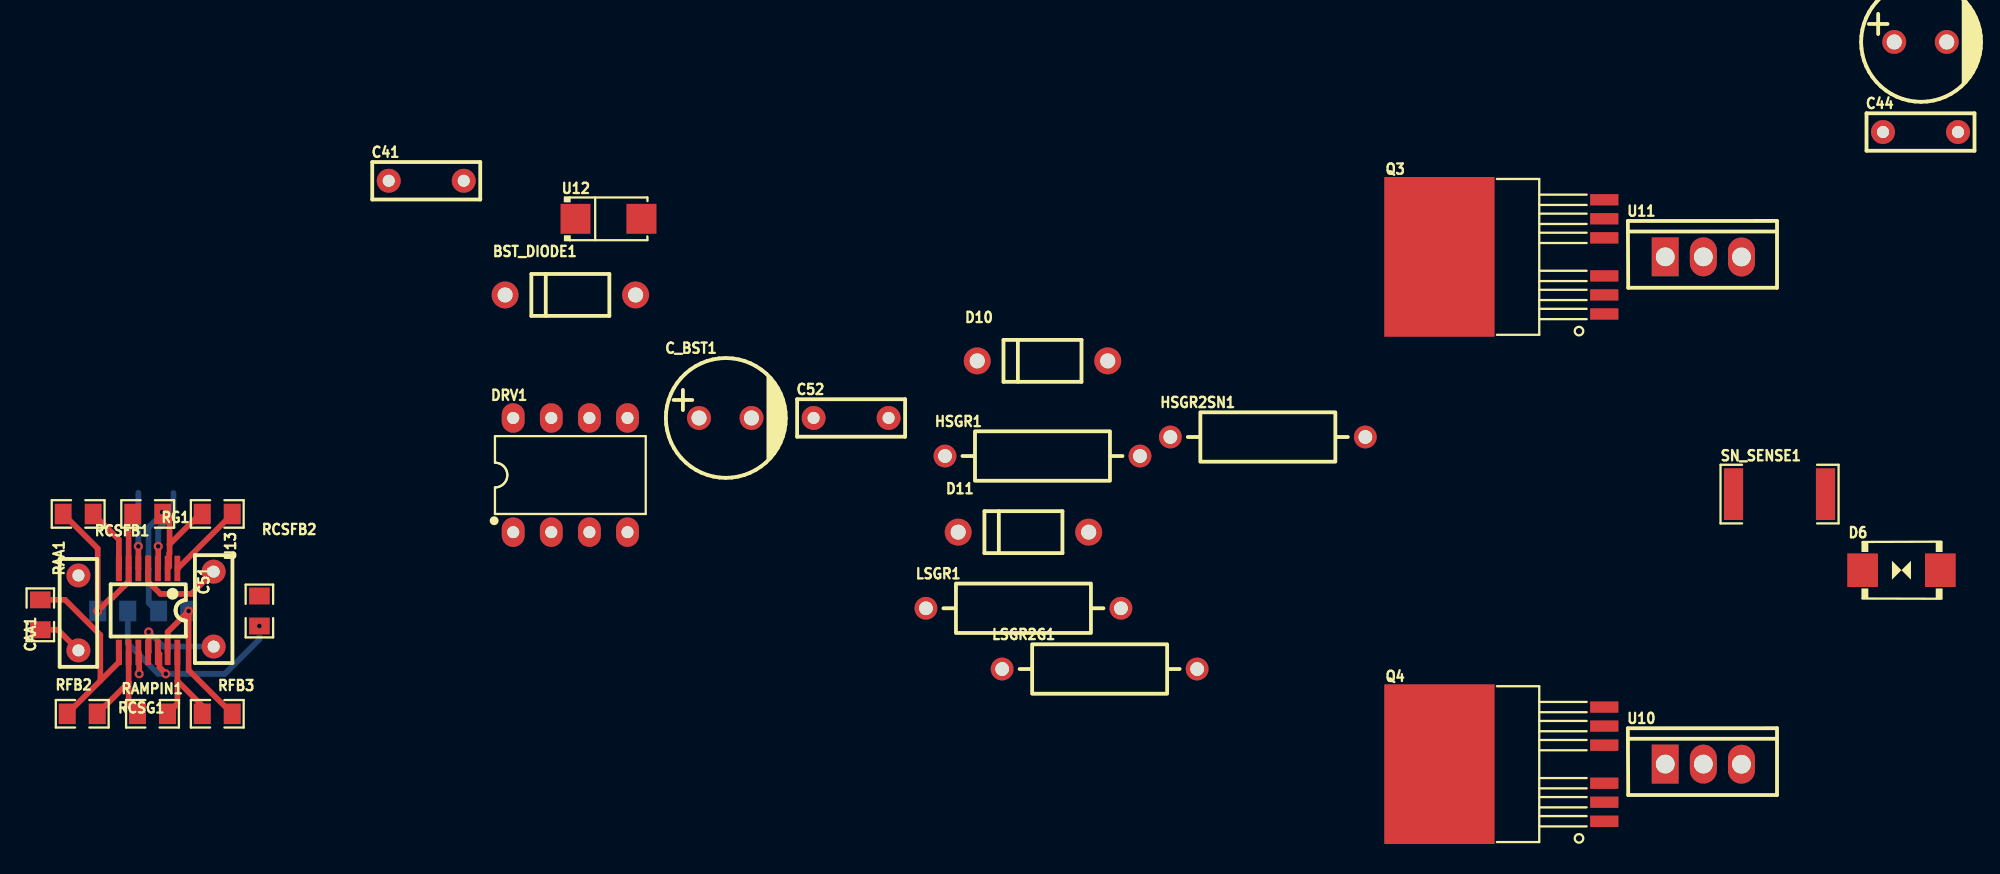
[diagram p5: board, top side]
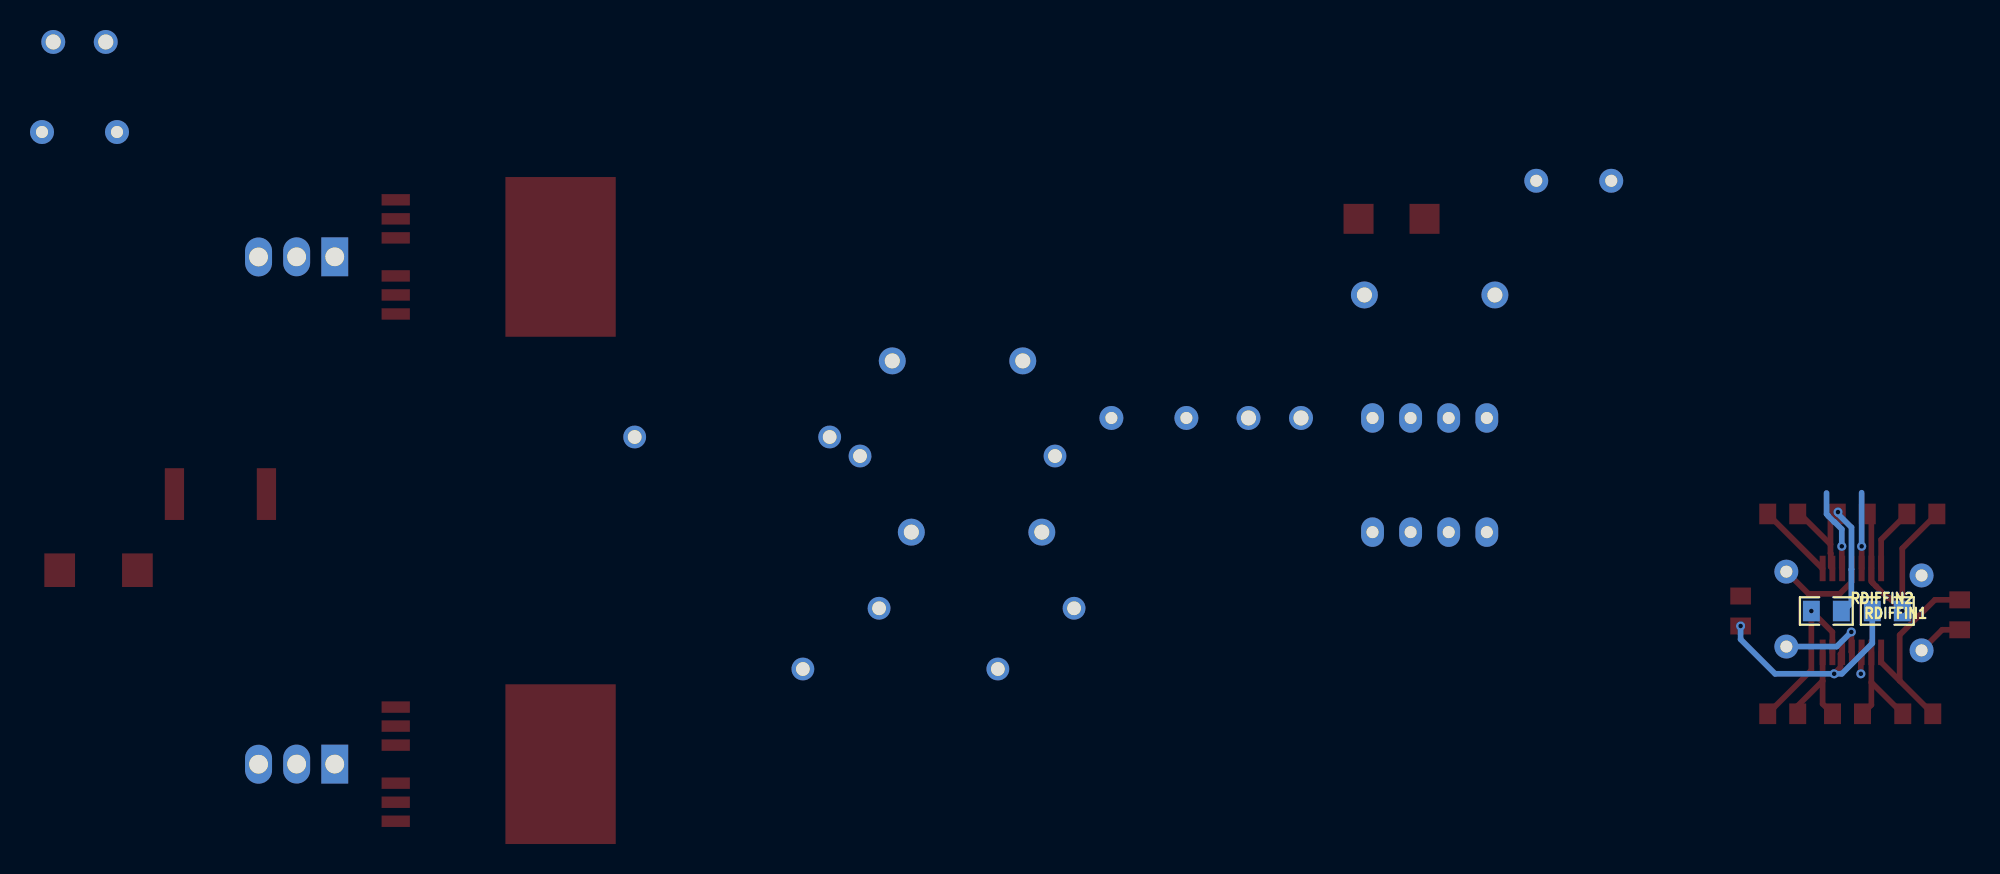
[diagram p6: board, bottom side, seen from below]

No outline. copper layers: Top Layer, Bottom Layer. Coordinates in mm from the lowest, leftmost part position.
Stack: Top Layer 0.035mm / Dielectric1 1.51mm FR4 er 4.5 / Bottom Layer 0.035mm

## Design rules (mm)
template: JLCPCB Capability(Two Layers Board)
spacing copperThickness1oz (default): track to track 0.102, other pairs 0.152 to 0.3
spacing copperThickness2oz: track to track 0.203, other pairs 0.152 to 0.3
track width copperThickness1oz (default): min 0.127, default 0.254, max 2.54
track width copperThickness2oz: min 0.203, default 0.254, max 2.54
differential pair differentialPair (default): width min 0.127, default 0.254, max 2.54; gap min 0.152, default 0.152
via viaSize (default): diameter min 0.5, default 0.61, max 10; hole min 0.3, default 0.305, max 6.3

## Placement (name value [footprint] x y rotation side)
BST_DIODE1  -  [DO-41_BD2.4-L4.7-P8.70-D0.9-RD]  35.34 31.31 0 top
C41  470nF  [CAP-TH_L7.2-W2.5-P5.00-D0.5]  25.73 38.93 0 top
C44  470nF  [CAP-TH_L7.2-W2.5-P5.00-D0.5]  125.35 42.19 0 top
C49  100uF  [CAP-TH_BD8.0-P3.50-D0.6-FD]  125.35 48.2 0 top
C51  470nF  [CAP-TH_L7.2-W2.5-P5.00-D0.5]  11.56 10.35 90 top
C52  470nF  [CAP-TH_L7.2-W2.5-P5.00-D0.5]  54.06 23.1 0 top
C_BST1  100uF  [CAP-TH_BD8.0-P3.50-D0.6-FD]  45.66 23.1 0 top
CAA1  470nF  [CAP-TH_L7.2-W2.5-P5.00-D0.5]  2.54 10.09 270 top
D6  P6SMB6.8CA/TR13  [SMB_L4.6-W3.6-LS5.3-BI]  124.08 12.94 0 top
D10  -  [DO-41_BD2.4-L4.7-P8.70-D0.9-RD]  66.81 26.91 0 top
D11  -  [DO-41_BD2.4-L4.7-P8.70-D0.9-RD]  65.54 15.48 0 top
DRV1  IR2104PBF  [DIP-8_L9.9-W6.6-P2.54-LS7.62-BL]  35.34 19.29 0 top
HSGR1  11  [RES-TH_BD3.3-L9.0-P13.00-D0.6]  66.81 20.56 0 top
HSGR2SN1  11k  [RES-TH_BD3.3-L9.0-P13.00-D0.6]  81.84 21.83 0 top
LSGR1  11  [RES-TH_BD3.3-L9.0-P13.00-D0.6]  65.54 10.4 0 top
LSGR2G1  11k  [RES-TH_BD3.3-L9.0-P13.00-D0.6]  70.62 6.35 0 top
Q3  IRF2804STRL7PP  [D2PAK-7_L10.6-W9.6-P1.27-LS15.9-BR]  98.77 33.85 0 top
Q4  IRF2804STRL7PP  [D2PAK-7_L10.6-W9.6-P1.27-LS15.9-BR]  98.77 0 0 top
RAA1  2MΩ  [R0805]  0 9.97 90 top
RAMPIN1  2MΩ  [R0805]  7.48 3.36 180 top
RCSFB1  2MΩ  [R0805]  2.52 16.7 180 top
RCSFB2  2MΩ  [R0805]  11.8 16.7 0 top
RCSG1  2MΩ  [R0805]  14.6 10.22 90 top
RDIFFIN1  2MΩ  [R0805]  4.83 10.22 0 bottom
RDIFFIN2  2MΩ  [R0805]  8.89 10.22 0 bottom
RFB2  2MΩ  [R0805]  2.79 3.36 0 top
RFB3  2MΩ  [R0805]  11.8 3.36 0 top
RG1  2MΩ  [R0805]  7.16 16.7 0 top
SN_SENSE1  5mΩ  [R2512]  115.96 18.02 0 top
U10  IRFZ44N  [TO-220-3_L9.9-W4.5-P2.54-L]  110.88 0 0 top
U11  IRFZ44N  [TO-220-3_L9.9-W4.5-P2.54-L]  110.88 33.85 0 top
U12  1N5822  [SMA_L4.3-W2.6-LS5.1-RD]  37.88 36.39 0 top
U13  LM324PWR  [TSSOP-14_L5.0-W4.4-P0.65-LS6.4-BL]  7.19 10.26 180 top

## Footprints (pads in the part's own frame, mm; a bottom-side part is the same pattern mirrored in y, then rotated)
CAP-TH_BD8.0-P3.50-D0.6-FD
  round 1.6 hole 1: 1(-1.75,0) 2(1.75,0)
CAP-TH_L7.2-W2.5-P5.00-D0.5
  round 1.6 hole 0.8: 1(-2.5,0) 2(2.5,0)
D2PAK-7_L10.6-W9.6-P1.27-LS15.9-BR
  rect 1.887x0.762 smd: 1(5.495,-3.81) 2(5.495,-2.54) 3(5.495,-1.27) 5(5.495,1.27) 6(5.495,2.54) 7(5.495,3.81)
  rect 7.356x10.66 smd: 4(-5.495,0)
DIP-8_L9.9-W6.6-P2.54-LS7.62-BL
  oval 1.524x1.97 hole 0.8: 1(-3.81,-3.81) 2(-1.27,-3.81) 3(1.27,-3.81) 4(3.81,-3.81) 5(3.81,3.81) 6(1.27,3.81) 7(-1.27,3.81) 8(-3.81,3.81)
DO-41_BD2.4-L4.7-P8.70-D0.9-RD
  round 1.8 hole 1: 1(-4.35,0) 2(4.35,0)
R0805
  rect 1.133x1.377 smd: 1(-1,0) 2(1,0)
R2512
  rect 1.282x3.456 smd: 1(-3.067,0) 2(3.067,0)
RES-TH_BD3.3-L9.0-P13.00-D0.6
  round 1.524 hole 0.914: 1(-6.5,0) 2(6.5,0)
SMA_L4.3-W2.6-LS5.1-RD
  rect 2x2 smd: 1(-2.2,0) 2(2.2,0)
SMB_L4.6-W3.6-LS5.3-BI
  rect 2.047x2.241 smd: 1(-2.591,0) 2(2.591,0)
TO-220-3_L9.9-W4.5-P2.54-L
  rect 1.8x2.6 hole 1.25: 1(-2.54,0.005)
  oval 1.8x2.6 hole 1.25: 2(0,0.005) 3(2.54,-0.005)
TSSOP-14_L5.0-W4.4-P0.65-LS6.4-BL
  rect 0.4x1.7 smd: 1(-1.95,-2.8) 2(-1.3,-2.8) 3(-0.65,-2.8) 4(0,-2.8) 5(0.65,-2.8) 6(1.3,-2.8) 7(1.95,-2.8) 8(1.95,2.8) 9(1.3,2.8) 10(0.65,2.8) 11(0,2.8) 12(-0.65,2.8) 13(-1.3,2.8) 14(-1.95,2.8)

## Nets
12V: BST_DIODE1.2 C41.1 DRV1.1 U12.2
+5V: C51.2 U13.4
GND: C41.2 C44.2 C49.2 CAA1.1 D6.1 DRV1.4 LSGR2G1.1 Q4.2 Q4.3 Q4.5 Q4.6 Q4.7 RCSG1.2 U10.3 U13.10
VCC: C44.1 C49.1 Q3.4 U11.2
CS+: U13.3
CS-: U13.5
CS_AMPOUT: CAA1.2 RAA1.1
HIN: DRV1.2
HS_GATE: D10.2 HSGR1.2 HSGR2SN1.1 Q3.1 U11.1
HSO: D10.1 DRV1.7 HSGR1.1
LOW_RAIL: C51.1 U13.11
LS_GATE: D11.2 LSGR1.2 LSGR2G1.2 Q4.1 U10.1
LSO: D11.1 DRV1.5 LSGR1.1
NB_CS: RAMPIN1.1 RFB3.1 U13.14
SD#: DRV1.3
SN_SENSE+: C52.1 C_BST1.2 DRV1.6 HSGR2SN1.2 Q3.2 Q3.3 Q3.5 Q3.6 Q3.7 Q4.4 SN_SENSE1.2 U10.2 U11.3
SN_SENSE-: D6.2 SN_SENSE1.1
VB: BST_DIODE1.1 C52.2 C_BST1.1 DRV1.8 U12.1
$1N640: RAMPIN1.2 RFB2.2 U13.9
$1N642: RDIFFIN2.2 RFB3.2 U13.13
$1N644: RCSG1.1 RDIFFIN1.2 U13.12
$1N647: RCSFB2.1 RDIFFIN2.1 RG1.2 U13.2
$1N648: RCSFB1.2 RDIFFIN1.1 RG1.1 U13.6
$1N649: RCSFB1.1 U13.7
$1N650: RCSFB2.2 U13.1
$1N669: RAA1.2 RFB2.1 U13.8

## Via types
v1: diameter 0.61, hole 0.305, Top Layer to Bottom Layer, 9 vias

## Routing (per net, layer and track width the routed paths; a pad name or vN(x,y) marks a point on that pad's centre or on a via; arc(x,y) is an arc through that point)
+5V: length 6.2
  Top Layer w0.381: C51.2 10.07,11.36 8,11.36 7.19,12.18 U13.4
GND: length 1.5
  Top Layer w0.381: U13.10 6.59,7.41 v1(6.59,6.03)
CS+: length 5.5
  Top Layer w0.381: v1(7.86,14.54) 7.86,13.08 U13.3
  Bottom Layer w0.381: v1(7.86,14.54) 7.86,15.68 8.36,16.18 8.38,16.18 8.76,16.56 8.76,16.58 8.88,16.7 8.88,18.09
CS-: length 5.1
  Top Layer w0.381: U13.5 6.53,13.06 v1(6.53,14.54)
  Bottom Layer w0.381: v1(6.53,14.54) 6.53,18.11
CS_AMPOUT: length 3.1
  Top Layer w0.381: CAA1.2 1.17,8.97 RAA1.1
LOW_RAIL: length 6.1
  Top Layer w0.381: v1(7.22,8.82) 7.22,7.5 U13.11
  Bottom Layer w0.381: v1(7.22,8.82) 8.2,7.85 C51.1
NB_CS: length 7.3
  Top Layer w0.381: RAMPIN1.1 9.14,4.02 9.14,5.55 ; RFB3.1 10.8,3.9 9.14,5.55 ; U13.14 9.14,5.55
$1N640: length 7.3
  Top Layer w0.381: RAMPIN1.2 5.89,3.95 5.89,5.46 ; RFB2.2 5.89,5.46 ; 5.89,5.46 U13.9
$1N642: length 11.4
  Top Layer w0.381: U13.13 8.49,8.82 v1(9.89,10.22) 9.89,6.27 RFB3.2
$1N644: length 15.3
  Top Layer w0.381: U13.12 7.94,7.35 7.94,6.47 8.37,6.05 v1(8.37,6.03)
  Bottom Layer w0.381: RDIFFIN1.2 5.83,8.06 7.86,6.03 v1(8.37,6.03) 12.3,6.03 14.6,8.33 v1(14.6,9.22)
$1N647: length 14.3
  Top Layer w0.381: 8.61,14.67 10.64,16.7 RCSFB2.1 ; 8.61,14.67 8.61,16.37 8.29,16.7 RG1.2 ; 8.61,14.67 8.61,14.07 8.59,14.05 8.59,13.17 U13.2
  Bottom Layer w0.381: v1(8.11,16.83) 8.11,16.7 7.21,15.8 7.21,13 7.22,12.99 7.22,10.76 7.76,10.22 RDIFFIN2.1
$1N648: length 14.9
  Top Layer w0.381: RG1.1 5.89,16.43 U13.6 5.89,12.19 5.78,12.08 5.78,12.07 5.58,11.87 5.57,11.87 4.81,11.11 4.72,11.11 v1(3.83,10.22) 3.83,14.4 RCSFB1.2
$1N649: length 4.3
  Top Layer w0.381: U13.7 5.24,14.98 RCSFB1.1
$1N650: length 5.2
  Top Layer w0.381: U13.1 9.16,13.06 RCSFB2.2
$1N669: length 13.5
  Top Layer w0.381: RFB2.1 4,5.57 ; 4,5.57 5.24,6.81 U13.8 ; 4,5.57 4,8.62 1.65,10.97 RAA1.2

# Board SPDV4_THT_PCB_1
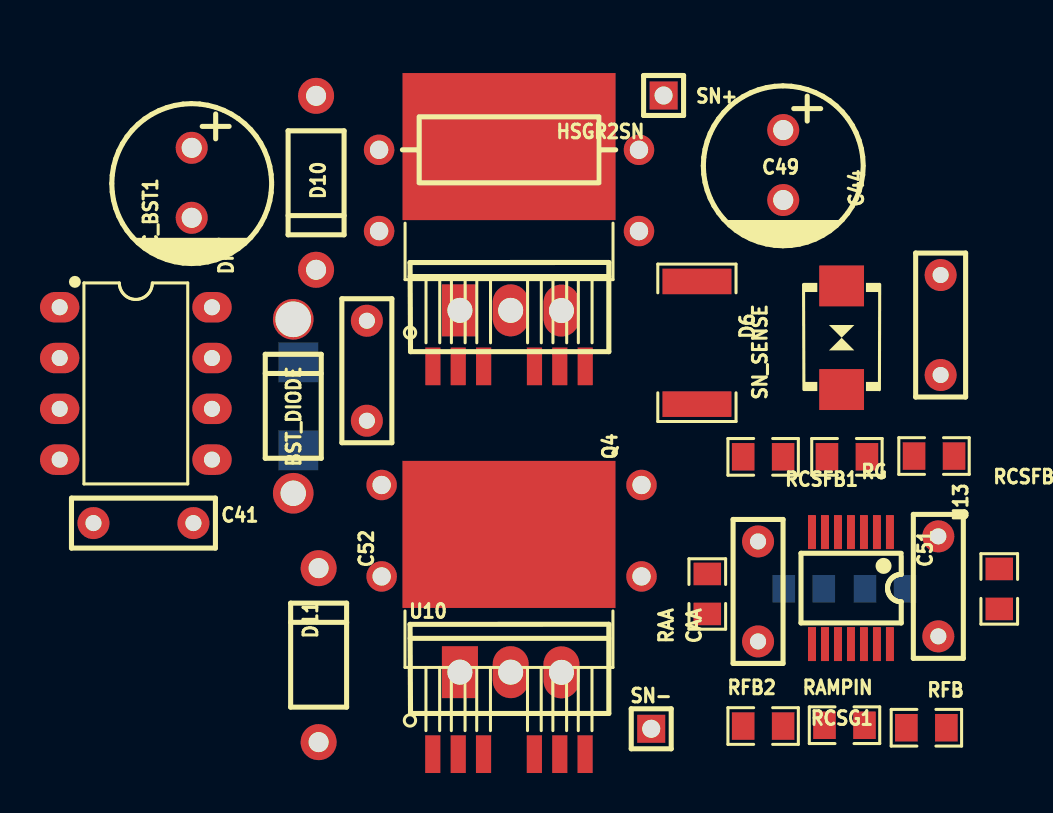
[diagram p7: board, top side]
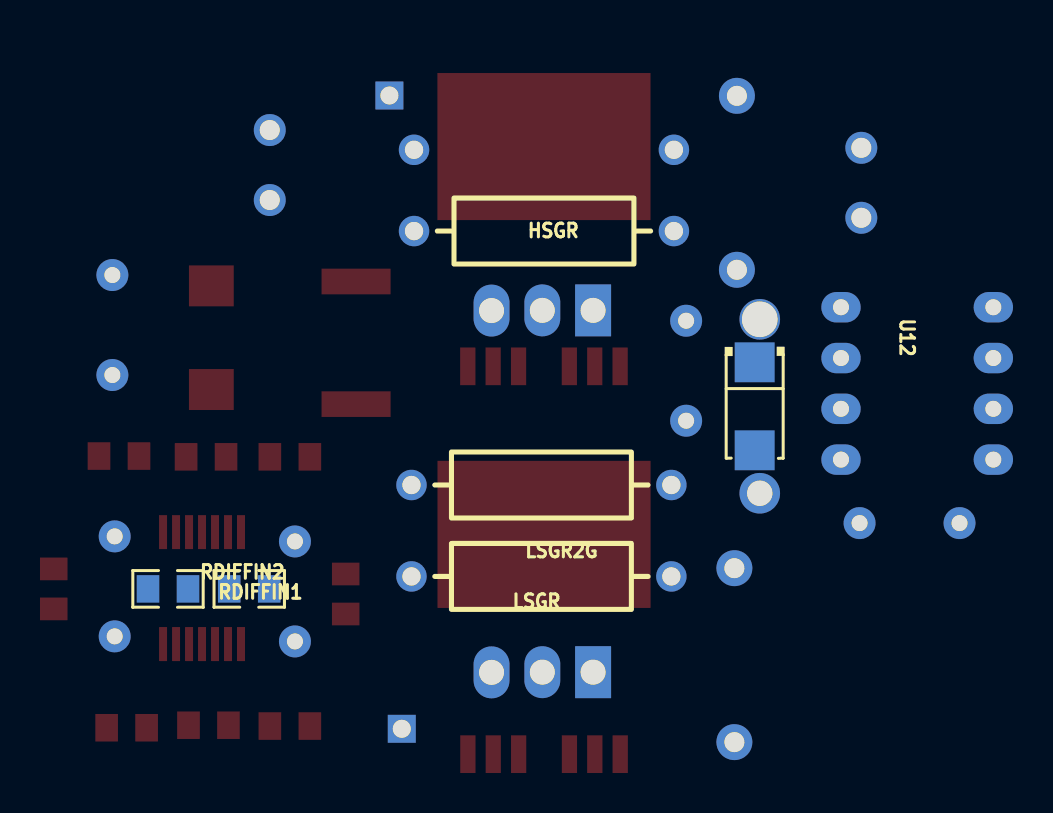
[diagram p8: board, bottom side, seen from below]

No outline. copper layers: Top Layer, GND, Inner2, Bottom Layer. Coordinates in mm from the lowest, leftmost part position.
Stack: Top Layer 0.035mm Outer layer thickness 1oz / Dielectric1 0.2104mm 7628 RC49% 8.6mil / GND 0.0152mm 内层铜厚 / Dielectric2 1.065mm 1.1mm H/HOZ Copper / Inner2 0.0152mm Inner layer thickness / Dielectric3 0.2104mm 7628 RC49% 8.6mil / Bottom Layer 0.035mm Outer layer thickness 1oz

## Design rules (mm)
template: Custom Config
spacing copperThickness1oz (default): track to track 0.102, other pairs 0.152 to 0.3
spacing copperThickness2oz: track to track 0.203, other pairs 0.152 to 0.3
track width copperThickness1oz (default): min 0.127, default 0.254, max 2.54
track width copperThickness2oz: min 0.203, default 0.254, max 2.54
differential pair differentialPair (default): width min 0.127, default 0.254, max 2.54; gap min 0.152, default 0.152
via viaSize (default): diameter min 0.5, default 0.61, max 10; hole min 0.3, default 0.305, max 6.3

## Placement (name value [footprint] x y rotation side)
BST_DIODE  -  [do-41_bd2.4-l4.7-p8.70-d0.9-rd]  7.87 16.13 270 top
C41  470nF  [CAP-TH_L7.2-W2.5-P5.00-D0.5]  0.38 10.29 180 top
C44  470nF  [CAP-TH_L7.2-W2.5-P5.00-D0.5]  40.26 20.19 270 top
C49  100uF  [CAP-TH_BD8.0-P3.50-D0.6-FD]  32.39 28.19 270 top
C51  470nF  [CAP-TH_L7.2-W2.5-P5.00-D0.5]  40.14 7.12 90 top
C52  470nF  [CAP-TH_L7.2-W2.5-P5.00-D0.5]  11.56 17.91 90 top
C_BST1  100uF  [CAP-TH_BD8.0-P3.50-D0.6-FD]  2.79 27.31 270 top
CAA  470nF  [CAP-TH_L7.2-W2.5-P5.00-D0.5]  31.13 6.87 270 top
D6  P6SMB6.8CA/TR13  [SMB_L4.6-W3.6-LS5.3-BI]  35.31 19.56 90 top
D10  -  [DO-41_BD2.4-L4.7-P8.70-D0.9-RD]  9.02 27.31 90 top
D11  -  [DO-41_BD2.4-L4.7-P8.70-D0.9-RD]  9.14 3.68 270 top
DRV  IR2104PBF  [DIP-8_L9.9-W6.6-P2.54-LS7.62-BL]  0 17.27 270 top
HSGR  11  [RES-TH_BD3.3-L9.0-P13.00-D0.6]  18.67 24.89 180 bottom
HSGR2SN  11k  [RES-TH_BD3.3-L9.0-P13.00-D0.6]  18.67 28.96 0 top
LSGR  11  [RES-TH_BD3.3-L9.0-P13.00-D0.6]  18.8 7.62 180 bottom
LSGR2G  11k  [RES-TH_BD3.3-L9.0-P13.00-D0.6]  18.8 12.19 180 bottom
Q3  IRF2804STRL7PP  [d2pak-7_l10.6-w9.6-p1.27-ls15.9-br]  18.67 23.62 270 top
Q4  IRF2804STRL7PP  [D2PAK-7_L10.6-W9.6-P1.27-LS15.9-BR]  18.66 4.23 270 top
RAA  2MΩ  [R0805]  28.59 6.74 270 top
RAMPIN  2MΩ  [R0805]  35.45 0.18 180 top
RCSFB1  2MΩ  [R0805]  31.38 13.6 180 top
RCSFB2  2MΩ  [R0805]  39.93 13.64 0 top
RCSG1  2MΩ  [R0805]  43.19 7 90 top
RDIFFIN1  2MΩ  [R0805]  33.41 7 0 bottom
RDIFFIN2  2MΩ  [R0805]  37.48 7 0 bottom
RFB  2MΩ  [R0805]  39.55 0.05 0 top
RFB2  2MΩ  [R0805]  31.38 0.14 0 top
RG  2MΩ  [R0805]  35.57 13.6 0 top
SN+  -  [HDR-TH_1P-V-M_XKB_X4611WV-01I-C28D40]  26.4 31.67 0 top
SN-  -  [HDR-TH_1P-V-M_XKB_X4611WV-01I-C28D40]  25.78 0 0 top
SN_SENSE  5mΩ  [R2512]  28.07 19.3 270 top
U10  IRFZ44N  [TO-220-3_L9.9-W4.5-P2.54-L]  18.75 2.83 0 top
U11  IRFZ44N  [TO-220-3_L9.9-W4.5-P2.54-L]  18.75 20.92 0 top
U12  1N5822  [SMA_L4.3-W2.6-LS5.1-RD]  8.13 16.13 270 bottom
U13  LM324PWR  [TSSOP-14_L5.0-W4.4-P0.65-LS6.4-BL]  35.77 7.04 180 top

## Footprints (pads in the part's own frame, mm; a bottom-side part is the same pattern mirrored in y, then rotated)
CAP-TH_BD8.0-P3.50-D0.6-FD
  round 1.6 hole 1: 1(-1.75,0) 2(1.75,0)
CAP-TH_L7.2-W2.5-P5.00-D0.5
  round 1.6 hole 0.8: 1(-2.5,0) 2(2.5,0)
D2PAK-7_L10.6-W9.6-P1.27-LS15.9-BR
  rect 1.887x0.762 smd: 1(5.495,-3.81) 2(5.495,-2.54) 3(5.495,-1.27) 5(5.495,1.27) 6(5.495,2.54) 7(5.495,3.81)
  rect 7.356x10.66 smd: 4(-5.495,0)
d2pak-7_l10.6-w9.6-p1.27-ls15.9-br
  rect 1.887x0.762 smd: 1(5.495,-3.81) 2(5.495,-2.54) 3(5.495,-1.27) 5(5.495,1.27) 6(5.495,2.54) 7(5.495,3.81)
  rect 7.356x10.66 smd: 4(-5.495,0)
DIP-8_L9.9-W6.6-P2.54-LS7.62-BL
  oval 1.524x1.97 hole 0.8: 1(-3.81,-3.81) 2(-1.27,-3.81) 3(1.27,-3.81) 4(3.81,-3.81) 5(3.81,3.81) 6(1.27,3.81) 7(-1.27,3.81) 8(-3.81,3.81)
do-41_bd2.4-l4.7-p8.70-d0.9-rd
  round 2.032 hole 1.778x1.27: 1(-4.35,0)
  round 2.032 hole 1.27: 2(4.35,0)
DO-41_BD2.4-L4.7-P8.70-D0.9-RD
  round 1.8 hole 1: 1(-4.35,0) 2(4.35,0)
HDR-TH_1P-V-M_XKB_X4611WV-01I-C28D40
  rect 1.4x1.4 hole 0.9: 1(0,0)
R0805
  rect 1.133x1.377 smd: 1(-1,0) 2(1,0)
R2512
  rect 1.282x3.456 smd: 1(-3.067,0) 2(3.067,0)
RES-TH_BD3.3-L9.0-P13.00-D0.6
  round 1.524 hole 0.914: 1(-6.5,0) 2(6.5,0)
SMA_L4.3-W2.6-LS5.1-RD
  rect 2x2 smd: 1(-2.2,0) 2(2.2,0)
SMB_L4.6-W3.6-LS5.3-BI
  rect 2.047x2.241 smd: 1(-2.591,0) 2(2.591,0)
TO-220-3_L9.9-W4.5-P2.54-L
  rect 1.8x2.6 hole 1.25: 1(-2.54,0.005)
  oval 1.8x2.6 hole 1.25: 2(0,0.005) 3(2.54,-0.005)
TSSOP-14_L5.0-W4.4-P0.65-LS6.4-BL
  rect 0.4x1.7 smd: 1(-1.95,-2.8) 2(-1.3,-2.8) 3(-0.65,-2.8) 4(0,-2.8) 5(0.65,-2.8) 6(1.3,-2.8) 7(1.95,-2.8) 8(1.95,2.8) 9(1.3,2.8) 10(0.65,2.8) 11(0,2.8) 12(-0.65,2.8) 13(-1.3,2.8) 14(-1.95,2.8)

## Nets
As in the schematic, except:
CS_AMPOUT: CAA.2 RAA.1
SN_SENSE+: C52.1 C_BST1.2 DRV.6 HSGR2SN.2 Q3.2 Q3.3 Q3.5 Q3.6 Q3.7 Q4.4 SN+.1 SN_SENSE.2 U10.2 U11.3 U13.3
SN_SENSE-: D6.2 SN-.1 SN_SENSE.1 U13.5
